# Altium schematic sheet LED_V3.SchDoc
size A
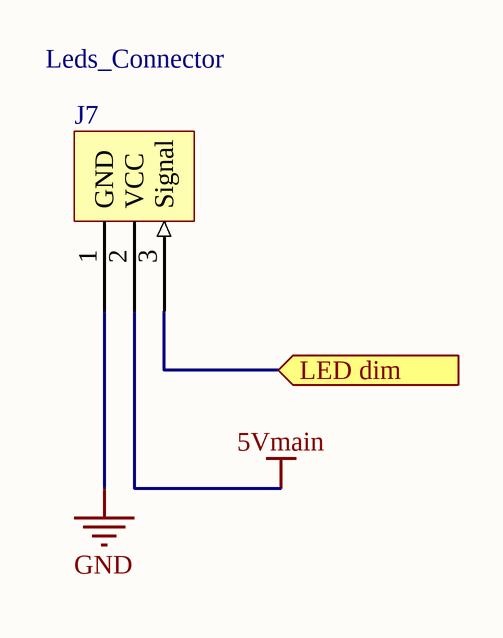
[diagram p0: LED_V3.SchDoc]

## Parts
J7  Leds_Connector  [LEDS CONNECTOR]

## Ports
LED dim (in)

## Nets
5Vmain: J7.2(VCC)
GND: J7.1(GND)
LED dim: J7.3(Signal) ; port LED dim

## Library data of the parts
J7 = Leds_Connector: Female Embase 3 contacts; fournisseur: Farnell; reffournisseur: 1845931; fabricant: TE CONNECTIVITY / AMP; reffabricant: 5-534237-1